# EAGLE design TapClipSound (EAGLE 6.2)
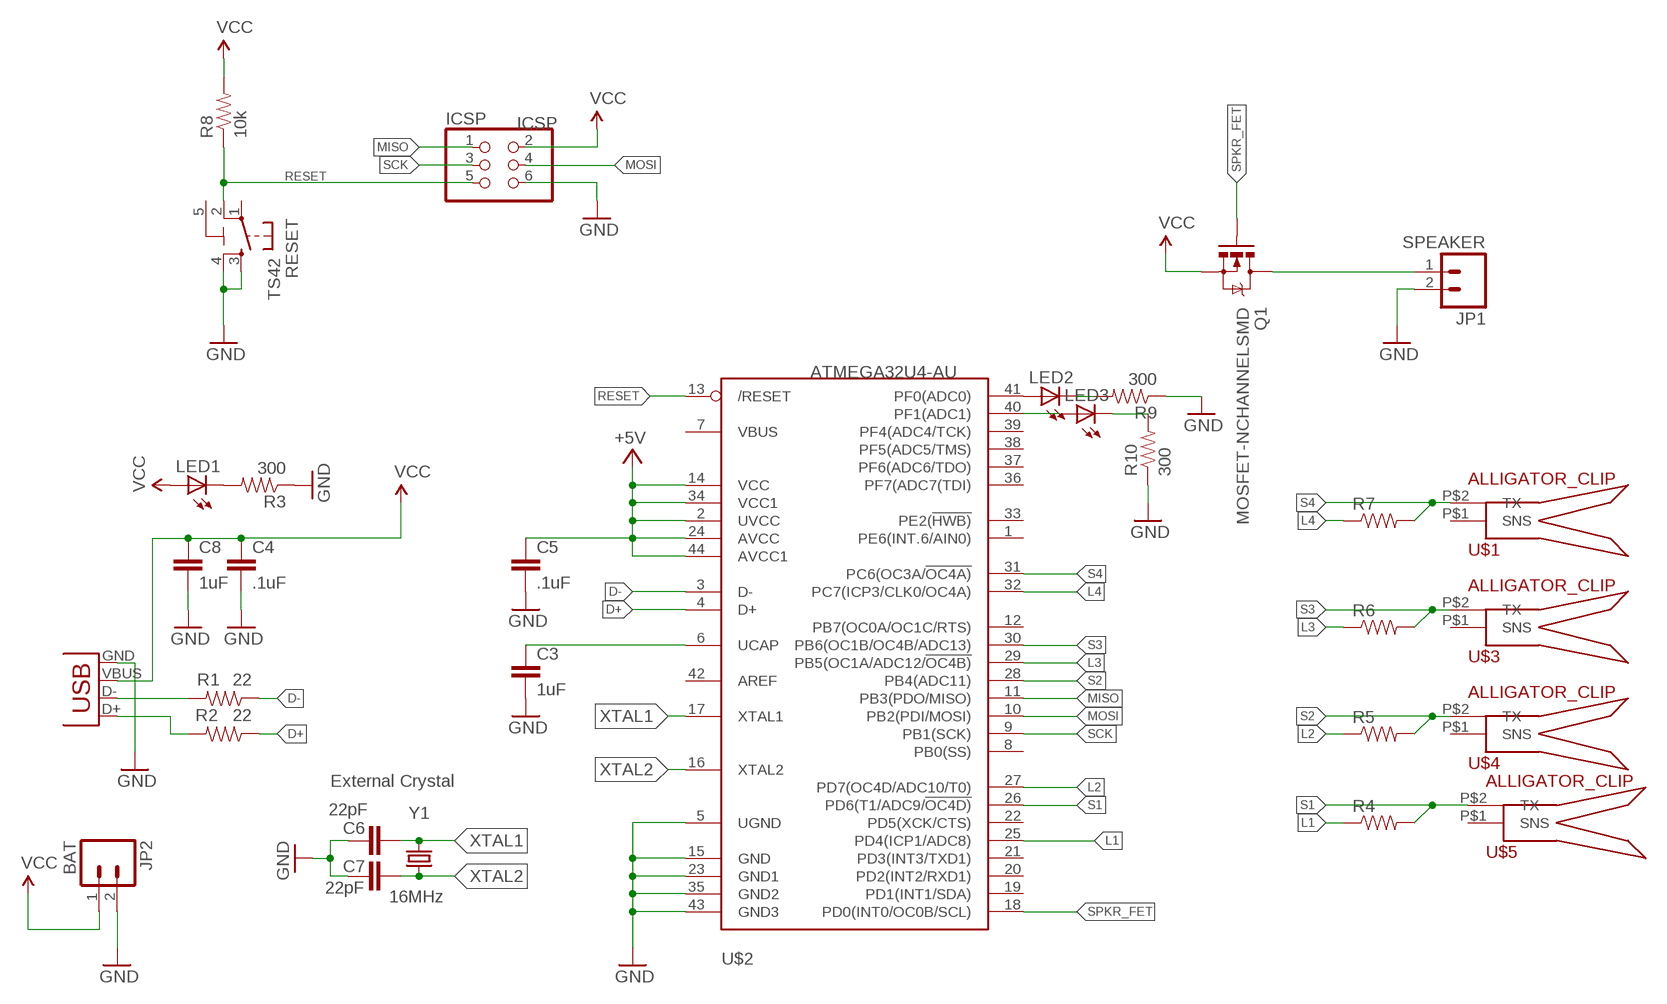
[diagram p0: schematic, sheet 1]

## Parts
C3  1uF  CAP0603-CAP  [0603-CAP]
C4  .1uF  CAP0603-CAP  [0603-CAP]
C5  .1uF  CAP0603-CAP  [0603-CAP]
C6  22pF  CAP0402-CAP  [0402-CAP]
C7  22pF  CAP0402-CAP  [0402-CAP]
C8  1uF  CAP0603-CAP  [0603-CAP]
ICSP  ICSP  PINHD-2X3  [2X03]
JP1  SPEAKER  M02LOCK_LONGPADS  [1X02_LOCK_LONGPADS]
JP2  BAT  M02LOCK_LONGPADS  [1X02_LOCK_LONGPADS]
LED1  LED0603  [LED-0603]
LED2  LED0603  [LED-0603]
LED3  LED0603  [LED-0603]
Q1  MOSFET-NCHANNELSMD  [SOT23-3]
R1  22  RESISTOR0402-RES  [0402-RES]
R2  22  RESISTOR0402-RES  [0402-RES]
R3  300  RESISTOR0603-RES  [0603-RES]
R4  RESISTOR0603-RES  [0603-RES]
R5  RESISTOR0603-RES  [0603-RES]
R6  RESISTOR0603-RES  [0603-RES]
R7  RESISTOR0603-RES  [0603-RES]
R8  10k  RESISTOR0603-RES  [0603-RES]
R9  300  RESISTOR0603-RES  [0603-RES]
R10  300  RESISTOR0603-RES  [0603-RES]
RESET  TS42  [TS42]
U$1  ALLIGATOR_CLIP  [ALLIGATOR_CLIP]
U$2  ATMEGA32U4-AU  [TQFP44]
U$3  ALLIGATOR_CLIP  [ALLIGATOR_CLIP]
U$4  ALLIGATOR_CLIP  [ALLIGATOR_CLIP]
U$5  ALLIGATOR_CLIP  [ALLIGATOR_CLIP]
X1  USBSMD  [USB-MINIB]
Y1  16MHz  CRYSTAL5X3  [CRYSTAL-SMD-5X3]

## Nets
D+: R2.1 U$2.4(D+)
D-: R1.1 U$2.3(D-)
GND [gnd]: C3.2 C4.2 C5.2 C6.2 C7.2 C8.2 ICSP.6 JP1.2 JP2.2 R3.1 R9.1 R10.1 RESET.3 RESET.4 U$2.5(UGND) U$2.15(GND) U$2.23(GND1) U$2.35(GND2) U$2.43(GND3) X1.GND
L1: R4.1 U$2.25(PD4(ICP1/ADC8))
L2: R5.1 U$2.27(PD7(OC4D/ADC10/T0))
L3: R6.1 U$2.29(PB5(OC1A/ADC12/!OC4B))
L4: R7.1 U$2.32(PC7(ICP3/CLK0/OC4A))
MISO: ICSP.1 U$2.11(PB3(PDO/MISO))
MOSI: ICSP.4 U$2.10(PB2(PDI/MOSI))
N$1: C3.1 U$2.6(UCAP)
N$2: LED1.C R3.2
N$3: JP1.1 Q1.3(D)
N$4: LED2.C R9.2
N$5: LED2.A U$2.41(PF0(ADC0))
N$6: R1.2 X1.D-
N$7: LED3.C R10.2
N$8: R2.2 X1.D+
N$9: LED3.A U$2.40(PF1(ADC1))
RESET: ICSP.5 R8.1 RESET.2 U$2.13(/RESET)
S1: R4.2 U$2.26(PD6(T1/ADC9/!OC4D)) U$5.P$2(TX)
S2: R5.2 U$2.28(PB4(ADC11)) U$4.P$2(TX)
S3: R6.2 U$2.30(PB6(OC1B/OC4B/ADC13)) U$3.P$2(TX)
S4: R7.2 U$1.P$2(TX) U$2.31(PC6(OC3A/!OC4A))
SCK: ICSP.3 U$2.9(PB1(SCK))
SPKR_FET: Q1.1(G) U$2.18(PD0(INT0/OC0B/SCL))
VCC: C4.1 C5.1 C8.1 ICSP.2 JP2.1 LED1.A Q1.2(S) R8.2 U$2.2(UVCC) U$2.14(VCC) U$2.24(AVCC) U$2.34(VCC1) U$2.44(AVCC1) X1.VBUS ; supply symbol labelled +5V
XTAL1: C6.1 U$2.17(XTAL1) Y1.3
XTAL2: C7.1 U$2.16(XTAL2) Y1.1
Unconnected: RESET.1 U$1.P$1(SNS) U$2.1(PE6(INT.6/AIN0)) U$2.7(VBUS) U$2.8(PB0(SS)) U$2.12(PB7(OC0A/OC1C/RTS)) U$2.19(PD1(INT1/SDA)) U$2.20(PD2(INT2/RXD1)) U$2.21(PD3(INT3/TXD1)) U$2.22(PD5(XCK/CTS)) U$2.33(PE2(!HWB)) U$2.36(PF7(ADC7(TDI)) U$2.37(PF6(ADC6/TDO)) U$2.38(PF5(ADC5/TMS)) U$2.39(PF4(ADC4/TCK)) U$2.42(AREF) U$3.P$1(SNS) U$4.P$1(SNS) U$5.P$1(SNS)

## Notes on the sheet
- External Crystal

## Power pins joined to a net without a drawn wire
5-GND: RESET.5(5-GND)

## Library data of the parts
C3-C8 = SparkFun:CAP: Capacitor Standard 0603 ceramic capacitor, and 0.1" leaded capacitor.
ICSP = SmartPrj:PINHD-2X3: PIN HEADER
JP1 JP2 = SparkFun:M02: Header 2 Standard 2-pin 0.1" header. Use with straight break away headers (SKU : PRT-00116), right angle break away headers (PRT-00553), swiss pins (PRT-00743), machine pins (PRT-00117), and female headers (PRT-00115). Molex polarized connector foot print use with SKU : PRT-08233 with associated crimp pins and housings.
LED1-LED3 = SparkFun:LED: LEDs Standard schematic elements and footprints for 5mm, 3mm, 1206, and 0603 sized LEDs. 5mm - Spark Fun Electronics SKU : COM-00529 (and others)
Q1 = SparkFun:MOSFET-NCHANNEL
R1-R10 = SparkFun:RESISTOR: Resistor Basic schematic elements and footprints for 0603, 1206, and PTH resistors.
RESET = SmartPrj:TS42: TS42 Dongnan Electronics Tact switch VDC 12V - 50mA
U$1 U$3-U$5 = sdgj:ALLIGATOR_CLIP
U$2 = adafruit:ATMEGA32U4: http://www.ladyada.net/library/eagle
X1 = SparkFun:USB: USB Connectors USB-B-PTH is fully proven SKU : PRT-00139 USB-miniB is fully proven SKU : PRT-00587 USB-A-PCB is untested. USB-A-H is throughly reviewed, but untested. Spark Fun Electronics SKU : PRT-00437 USB-B-SMT is throughly reviewed, but untested. Needs silkscreen touching up. USB-A-S has not been used/tested USB-MB-H has not been used/tested
Y1 = SparkFun:CRYSTAL: Crystals Various standard crystals. Proven footprints. Spark Fun Electronics SKU : COM-00534

## Net classes
0 default: width 0.203 mm
2 gnd: width 0.254 mm, drill 0.61 mm, clearance 0.254 mm

## Board
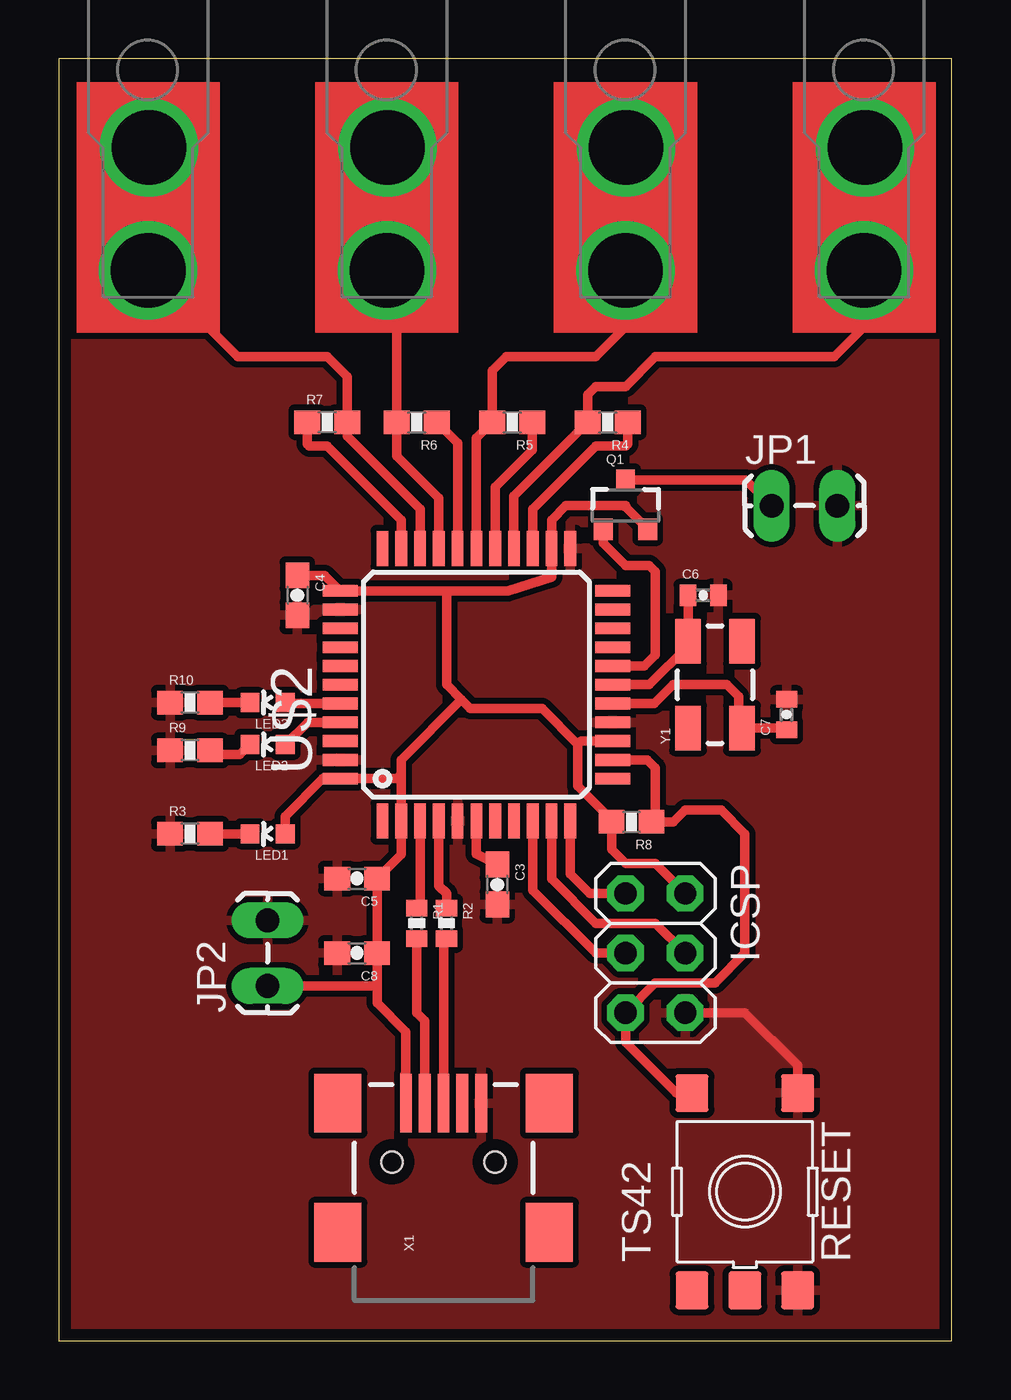
[diagram p1: board, top side]

Size 38.02 x 54.6 mm. Coordinates in mm from the lower left corner, seen from the top.
Outline: 0,0 38.02,0 38.02,54.6 0,54.6 0,0
Copper layers (1*16): Top 0.035mm / dielectric 1.5mm / Bottom 0.035mm
Design rules: minimum track width 10mil, minimum drill 24mil, track to track 10mil, track to pad 10mil, pad to pad 10mil, via to via 10mil, smd to smd 10mil, copper to edge 20mil, drill to drill 12mil, minimum pad ring 10mil, minimum via ring 8mil, stop-mask expansion 4mil, vias tented up to drill 0mil, thermal gap 10mil

### Footprints (pad centres in the part's own frame; a part is rotated, then mirrored left to right if it is on the bottom)
0603-CAP = smd 1.1 x 1: 1 -0.85,0; 2 0.85,0
0402-CAP = smd 0.7 x 0.9: 1 -0.65,0; 2 0.65,0
2X03 = drill 0.95 pad 1.55 octagon: 1 -2.54,-1.27; 2 -2.54,1.27; 3 0,-1.27; 4 0,1.27; 5 2.54,-1.27; 6 2.54,1.27
1X02_LOCK_LONGPADS = drill 1.016 long: 1 -0.127,0; 2 2.667,0
LED-0603 = smd 0.8 x 0.8: A 0,-0.75; C 0,0.75
SOT23-3 = smd 0.8 x 0.9: 1 -0.95,-1; 2 0.95,-1; 3 0,1.1
0402-RES = smd 0.7 x 0.9: 1 -0.65,0; 2 0.65,0
0603-RES = smd 1.1 x 1: 1 -0.85,0; 2 0.85,0
TS42 = smd 1.6 x 1.4: 1 -4.2,2.25; 2 4.2,2.25; 3 -4.2,-2.25; 4 4.2,-2.25; 5 -4.2,0
ALLIGATOR_CLIP = drill 3.175 pad 3.302: P$1 -2.667,0; P$2 2.565,-0.025
TQFP44 = smd 1.5 x 0.5: 1 -5.8,4; 2 -5.8,3.2; 3 -5.8,2.4; 4 -5.8,1.6; 5 -5.8,0.8; 6 -5.8,0; 7 -5.8,-0.8; 8 -5.8,-1.6; 9 -5.8,-2.4; 10 -5.8,-3.2; 11 -5.8,-4; 23 5.8,-4; 24 5.8,-3.2; 25 5.8,-2.4; 26 5.8,-1.6; 27 5.8,-0.8; 28 5.8,0; 29 5.8,0.8; 30 5.8,1.6; 31 5.8,2.4; 32 5.8,3.2; 33 5.8,4 | smd 0.5 x 1.5: 12 -4,-5.8; 13 -3.2,-5.8; 14 -2.4,-5.8; 15 -1.6,-5.8; 16 -0.8,-5.8; 17 0,-5.8; 18 0.8,-5.8; 19 1.6,-5.8; 20 2.4,-5.8; 21 3.2,-5.8; 22 4,-5.8; 34 4,5.8; 35 3.2,5.8; 36 2.4,5.8; 37 1.6,5.8; 38 0.8,5.8; 39 0,5.8; 40 -0.8,5.8; 41 -1.6,5.8; 42 -2.4,5.8; 43 -3.2,5.8; 44 -4,5.8
USB-MINIB = smd 2.5 x 0.5: D+ 2.5,0; D- 2.5,0.8; GND 2.5,-1.6; ID 2.5,-0.8; VBUS 2.5,1.6 | smd 2.5 x 2: MTN1 -3,4.5; MTN2 2.5,4.5; MTN3 -3,-4.5; MTN4 2.5,-4.5 | hole 0.9: 0,2.2; 0,-2.2
CRYSTAL-SMD-5X3 = smd 1.9 x 1.1: 1 -1.85,-1.15; 2 1.85,-1.15; 3 1.85,1.15; 4 -1.85,1.15

### Placement (x,y rotation side)
C3  18.67,19.43 270 top
C4  10.16,31.75 270 top
C5  12.7,19.69 180 top
C6  27.43,31.75 0 top
C7  30.99,26.67 90 top
C8  12.7,16.51 180 top
ICSP  25.4,16.51 270 top
JP1  30.48,35.56 0 top
JP2  8.89,15.24 90 top
LED1  8.89,21.59 90 top
LED2  8.89,25.4 90 top
LED3  8.89,27.18 90 top
Q1  24.13,35.56 0 top
R1  15.24,17.78 270 top
R2  16.51,17.78 270 top
R3  5.59,21.59 0 top
R4  23.37,39.12 180 top
R5  19.3,39.12 180 top
R6  15.24,39.12 180 top
R7  11.43,39.12 0 top
R8  24.38,22.1 180 top
R9  5.59,25.15 0 top
R10  5.59,27.18 0 top
RESET  29.21,6.35 90 top
U$1  3.81,48.26 90 top
U$2  17.78,27.94 90 top
U$3  13.97,48.26 90 top
U$4  24.13,48.26 90 top
U$5  34.29,48.26 90 top
X1  16.38,7.62 90 top
Y1  27.94,27.94 90 top

### Tracks (layer width: path | path; a pad name or v marks a point on that pad's centre or on a via)
D+
  Top 0.406: U$2.4 16.18,19.38 16.51,19.05 R2.1
D-
  Top 0.406: U$2.3 15.38,18.57 R1.1
GND
  Top 0.406: ICSP.6 29.21,13.97 31.46,11.72 RESET.4
  pour Top: 0,54.61 38.1,54.61 38.1,0 0,0
L1
  Top 0.406: U$2.25 20.18,35.42 22.86,38.1 24.13,38.1 24.22,38.19 R4.1
L2
  Top 0.406: R5.1 20.15,37.93 18.58,36.36 U$2.27
L3
  Top 0.406: U$2.29 16.98,38.23 R6.1
L4
  Top 0.406: U$2.32 14.58,34.95 11.43,38.1 10.67,38.1 10.58,38.19 R7.1
MISO
  Top 0.406: U$2.11 21.78,19.88 22.61,19.05 ICSP.1
MOSI
  Top 0.406: U$2.10 20.98,19.66 22.86,17.78 25.4,17.78 ICSP.4
N$1
  Top 0.406: U$2.6 17.78,20.74 C3.1
N$2
  Top 0.406: LED1.C R3.2
N$3
  Top 0.406: Q1.3 29.25,36.66 JP1.1
N$4
  Top 0.406: R9.2 6.69,24.97 7.71,24.97 LED2.C
N$5
  Top 0.406: LED2.A 9.65,25.4 10.59,26.34 U$2.41
N$6
  Top 0.406: R1.2 15.24,13.97 15.58,13.63 X1.D-
N$7
  Top 0.406: LED3.C R10.2
N$8
  Top 0.406: X1.D+ 16.38,17 R2.2
N$9
  Top 0.406: U$2.40 10.11,27.14 LED3.A
RESET
  Top 0.406: RESET.2 26.28,10.55 24.13,12.7 ICSP.5 25.4,15.24 27.94,15.24 29.21,16.51 29.21,21.59 28.19,22.61 26.67,22.61 26.16,22.1 R8.1 25.4,22.26 25.4,24.38 25.04,24.74 U$2.13
S1
  Top 0.406: U$2.26 19.38,35.98 R4.2 22.52,40.3 22.86,40.64 24.13,40.64 25.4,41.91 33.02,41.91 34.29,43.18 34.29,50.8 U$5.P$2
S2
  Top 0.406: U$2.28 17.78,38.44 R5.2 18.45,41.31 19.05,41.91 22.86,41.91 24.13,43.18 | 24.13,43.18 24.13,50.8 | 24.13,50.8 24.13,52.07 | U$4.P$2 24.13,50.8 | 24.13,43.18 24.13,50.8
S3
  Top 0.406: U$2.30 16.18,35.89 14.39,37.68 R6.2 14.39,44.03 13.97,44.45 13.97,50.8 U$3.P$2
S4
  Top 0.406: U$2.31 15.38,35.42 12.28,38.52 R7.2 12.28,41.06 11.43,41.91 7.62,41.91 2.54,46.99 2.54,50.8 2.57,50.83 U$1.P$2
SCK
  Top 0.406: U$2.9 20.18,19.19 22.86,16.51 ICSP.3
SPKR_FET
  Top 0.406: U$2.18 24.93,28.74 25.4,29.21 25.4,32.77 25.15,33.02 24.13,33.02 23.18,33.97 Q1.1
VCC
  Top 0.406: C4.1 11.32,32.6 U$2.34 16.51,31.94 | 14.58,24.13 U$2.2 14.58,20.72 C5.1 C8.1 13.55,15.24 | 14.58,24.13 14.58,24.74 17.15,27.3 | U$2.14 22.24,25.54 22.1,25.4 | 22.1,25.4 22.1,23.62 23.53,22.19 R8.2 23.53,20.92 24.13,20.32 25.4,20.32 ICSP.2 | 22.1,25.4 20.57,26.92 17.53,26.92 17.15,27.3 | 13.55,15.24 13.55,14.39 14.78,13.16 X1.VBUS 14.73,11.34 | JP2.1 13.42,15.11 13.55,15.24 | Q1.2 24.13,35.51 24.13,35.56 21.59,35.56 20.98,34.95 U$2.24 20.98,32.54 19.11,31.94 16.51,31.94 | 17.15,27.3 16.51,27.94 16.51,31.94 | 14.58,24.13 14.39,23.94 U$2.44 11.24,23.94 9.64,22.34 LED1.A
XTAL1
  Top 0.406: C6.1 Y1.3 26.79,29.58 25.15,27.94 U$2.17
XTAL2
  Top 0.406: U$2.16 25.36,27.14 26.16,27.94 28.45,27.94 28.96,27.43 28.96,26.22 Y1.1 30.92,26.09 C7.1
(copper drawn outside any net)
  shapes: Top area x4